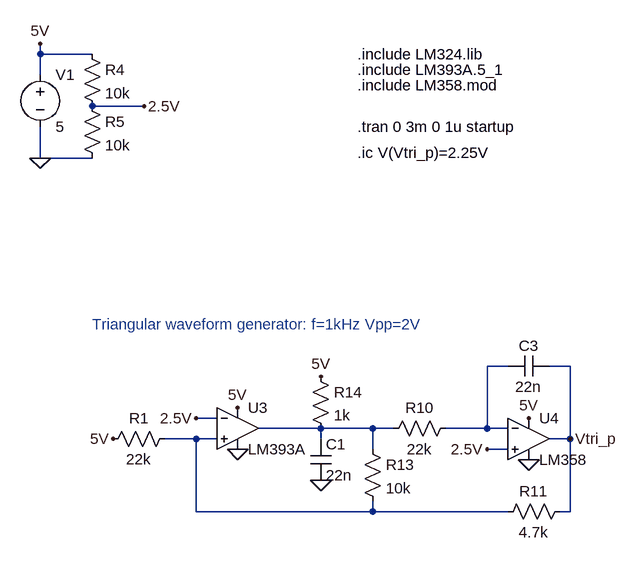
[diagram p0: schematic Switch_Signal_Sim.asc]
Switch_Signal_Sim.asc, the LTspice schematic file:
Version 4.1
SHEET 1 2064 680
WIRE -64 -432 -64 -448
WIRE 16 -432 -64 -432
WIRE -64 -400 -64 -432
WIRE 96 -352 16 -352
WIRE -64 -272 -64 -320
WIRE 16 -272 -64 -272
WIRE 656 48 624 48
WIRE 752 48 720 48
WIRE 208 128 176 128
WIRE 368 144 272 144
WIRE 448 144 368 144
WIRE 480 144 448 144
WIRE 624 144 624 48
WIRE 624 144 560 144
WIRE 656 144 624 144
WIRE 176 160 128 160
WIRE 208 160 176 160
WIRE 368 160 368 144
WIRE 752 160 752 48
WIRE 752 160 720 160
WIRE 448 176 448 144
WIRE 656 176 624 176
WIRE 176 272 176 160
WIRE 448 272 448 256
WIRE 448 272 176 272
WIRE 656 272 448 272
WIRE 752 272 752 160
WIRE 752 272 736 272
FLAG -64 -272 0
FLAG -64 -448 5V
FLAG 96 -352 2.5V
FLAG 176 128 2.5V
FLAG 624 176 2.5V
FLAG 240 112 5V
FLAG 688 128 5V
FLAG 240 176 0
FLAG 688 192 0
FLAG 368 224 0
FLAG 368 64 5V
FLAG 752 160 Vtri_p
FLAG 48 160 5V
SYMBOL voltage -64 -416 R0
WINDOW 123 0 0 Left 0
WINDOW 39 0 0 Left 0
SYMATTR InstName V1
SYMATTR Value 5
SYMBOL OpAmps\\opamp2 240 80 R0
SYMATTR InstName U3
SYMATTR Value LM393A
SYMBOL OpAmps\\opamp2 688 96 R0
SYMATTR InstName U4
SYMATTR Value LM358
SYMBOL res 0 -448 R0
SYMATTR InstName R4
SYMATTR Value 10k
SYMBOL res 0 -368 R0
SYMATTR InstName R5
SYMATTR Value 10k
SYMBOL cap 352 160 R0
SYMATTR InstName C1
SYMATTR Value 22n
SYMBOL res 576 128 R90
WINDOW 0 0 56 VBottom 2
WINDOW 3 32 56 VTop 2
SYMATTR InstName R10
SYMATTR Value 22k
SYMBOL cap 720 32 R90
WINDOW 0 0 32 VBottom 2
WINDOW 3 32 32 VTop 2
SYMATTR InstName C3
SYMATTR Value 22n
SYMBOL res 752 256 R90
WINDOW 0 0 56 VBottom 2
WINDOW 3 32 56 VTop 2
SYMATTR InstName R11
SYMATTR Value 4.7k
SYMBOL res 432 160 R0
SYMATTR InstName R13
SYMATTR Value 10k
SYMBOL res 352 48 R0
SYMATTR InstName R14
SYMATTR Value 1k
SYMBOL res 144 144 R90
WINDOW 0 0 56 VBottom 2
WINDOW 3 32 56 VTop 2
SYMATTR InstName R1
SYMATTR Value 22k
TEXT 424 -432 Left 2 !.include LM324.lib
TEXT 424 -320 Left 2 !.tran 0 3m 0 1u startup
TEXT 424 -280 Left 2 !.ic V(Vtri_p)=2.25V
TEXT 424 -408 Left 2 !.include LM393A.5_1
TEXT 424 -384 Left 2 !.include LM358.mod
TEXT 16 -16 Left 2 ;Triangular waveform generator: f=1kHz Vpp=2V

The netlist it stands for:
* Switch_Signal_Sim.asc
V1 5V 0 5
X§U3 N003 2.5V 5V 0 N002 LM393A  ; pins In+ In- V+ V- OUT
X§U4 2.5V N001 5V 0 Vtri_p LM358  ; pins In+ In- V+ V- OUT
R4 5V 2.5V 10k
R5 2.5V 0 10k
C1 N002 0 22n
R10 N001 N002 22k
C3 Vtri_p N001 22n
R11 Vtri_p N003 4.7k
R13 N002 N003 10k
R14 5V N002 1k
R1 N003 5V 22k
.include LM324.lib
.tran 0 3m 0 1u startup
.ic V(Vtri_p)=2.25V
.include LM393A.5_1
.include LM358.mod
* Triangular waveform generator: f=1kHz Vpp=2V
.backanno
.end

* Results of the author's LTspice run, read from the files saved beside the schematic
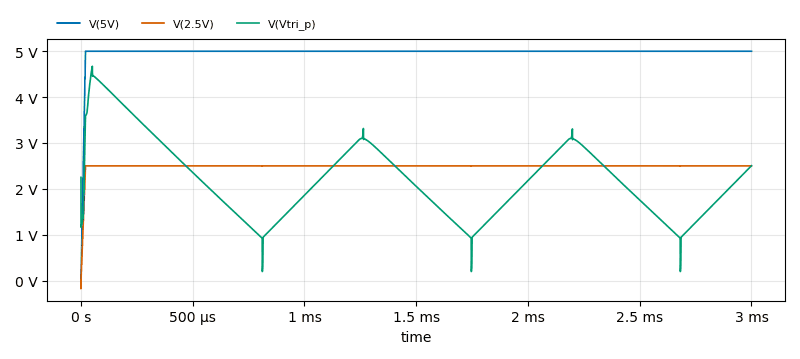
[diagram p1: Transient Analysis of Switch_Signal_Sim.asc, plotted from the saved traces]
* Transient Analysis, 1 run:
*   V(5V): min 0 V, max 5 V, average 4.983 V, rms 4.989 V, last 5 V
*   V(2.5V): min -180.7 mV, max 2.501 V, average 2.492 V, rms 2.495 V, last 2.5 V
*   V(Vtri_p): min 196.5 mV, max 4.672 V, average 2.188 V, rms 2.343 V, last 2.503 V